# Altium schematic sheet panel.SchDoc
size A
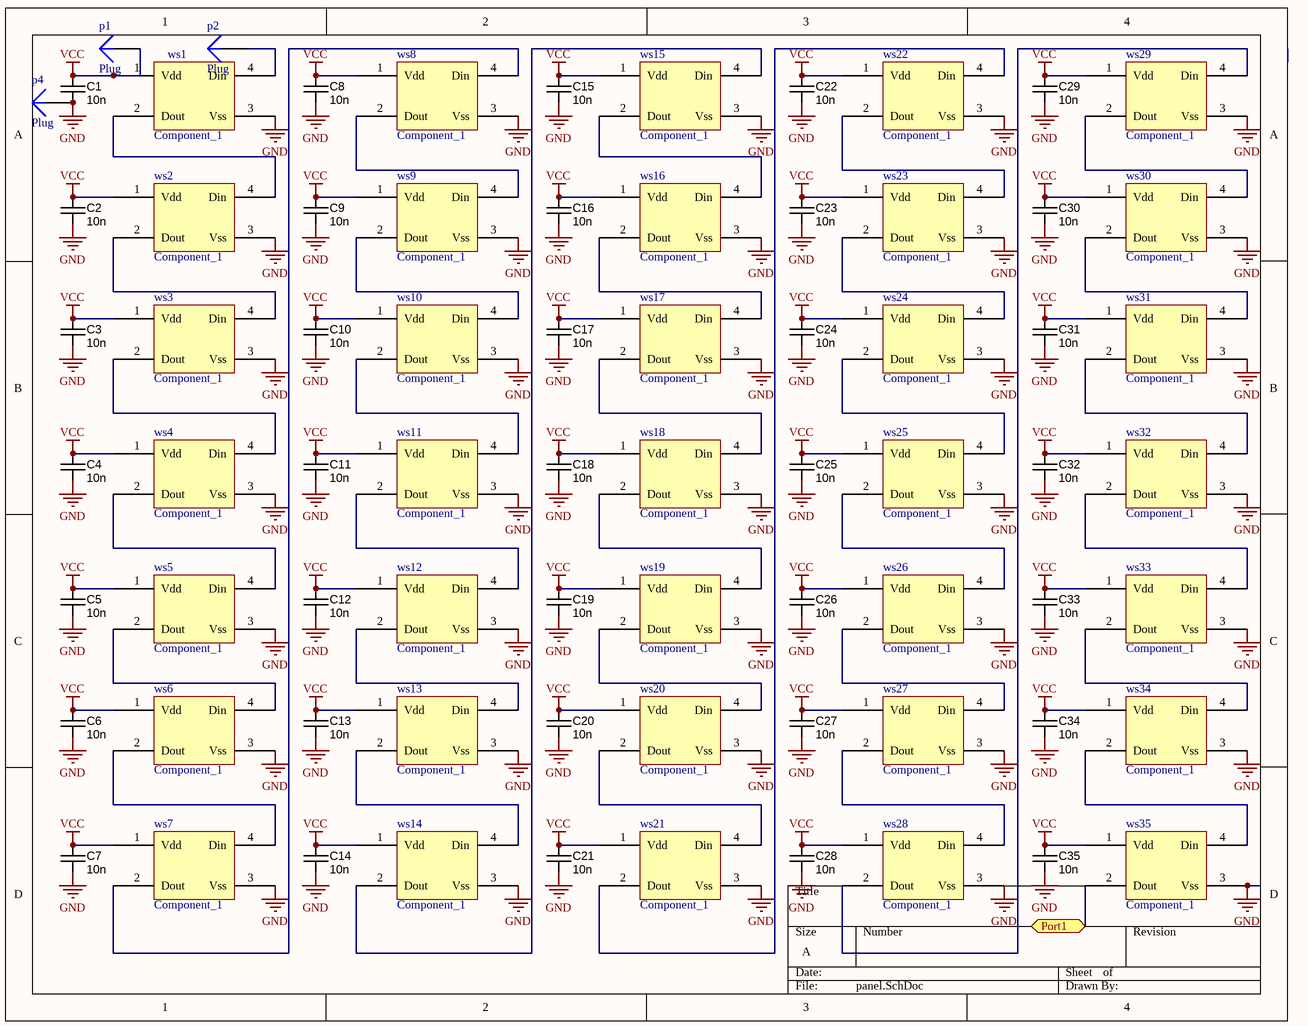
[diagram p0: panel.SchDoc]

## Parts
C1  value 10n  [CAPC1608X90N]  (hidden comment: approved sub OK)
C2  value 10n  [CAPC1608X90N]  (hidden comment: approved sub OK)
C3  value 10n  [CAPC1608X90N]  (hidden comment: approved sub OK)
C4  value 10n  [CAPC1608X90N]  (hidden comment: approved sub OK)
C5  value 10n  [CAPC1608X90N]  (hidden comment: approved sub OK)
C6  value 10n  [CAPC1608X90N]  (hidden comment: approved sub OK)
C7  value 10n  [CAPC1608X90N]  (hidden comment: approved sub OK)
C8  value 10n  [CAPC1608X90N]  (hidden comment: approved sub OK)
C9  value 10n  [CAPC1608X90N]  (hidden comment: approved sub OK)
C10  value 10n  [CAPC1608X90N]  (hidden comment: approved sub OK)
C11  value 10n  [CAPC1608X90N]  (hidden comment: approved sub OK)
C12  value 10n  [CAPC1608X90N]  (hidden comment: approved sub OK)
C13  value 10n  [CAPC1608X90N]  (hidden comment: approved sub OK)
C14  value 10n  [CAPC1608X90N]  (hidden comment: approved sub OK)
C15  value 10n  [CAPC1608X90N]  (hidden comment: approved sub OK)
C16  value 10n  [CAPC1608X90N]  (hidden comment: approved sub OK)
C17  value 10n  [CAPC1608X90N]  (hidden comment: approved sub OK)
C18  value 10n  [CAPC1608X90N]  (hidden comment: approved sub OK)
C19  value 10n  [CAPC1608X90N]  (hidden comment: approved sub OK)
C20  value 10n  [CAPC1608X90N]  (hidden comment: approved sub OK)
C21  value 10n  [CAPC1608X90N]  (hidden comment: approved sub OK)
C22  value 10n  [CAPC1608X90N]  (hidden comment: approved sub OK)
C23  value 10n  [CAPC1608X90N]  (hidden comment: approved sub OK)
C24  value 10n  [CAPC1608X90N]  (hidden comment: approved sub OK)
C25  value 10n  [CAPC1608X90N]  (hidden comment: approved sub OK)
C26  value 10n  [CAPC1608X90N]  (hidden comment: approved sub OK)
C27  value 10n  [CAPC1608X90N]  (hidden comment: approved sub OK)
C28  value 10n  [CAPC1608X90N]  (hidden comment: approved sub OK)
C29  value 10n  [CAPC1608X90N]  (hidden comment: approved sub OK)
C30  value 10n  [CAPC1608X90N]  (hidden comment: approved sub OK)
C31  value 10n  [CAPC1608X90N]  (hidden comment: approved sub OK)
C32  value 10n  [CAPC1608X90N]  (hidden comment: approved sub OK)
C33  value 10n  [CAPC1608X90N]  (hidden comment: approved sub OK)
C34  value 10n  [CAPC1608X90N]  (hidden comment: approved sub OK)
C35  value 10n  [CAPC1608X90N]  (hidden comment: approved sub OK)
p1  Plug  [PIN1]
p2  Plug  [PIN1]
p4  Plug  [PIN1]
ws1  Component_1  [SOP4]
ws2  Component_1  [SOP4]
ws3  Component_1  [SOP4]
ws4  Component_1  [SOP4]
ws5  Component_1  [SOP4]
ws6  Component_1  [SOP4]
ws7  Component_1  [SOP4]
ws8  Component_1  [SOP4]
ws9  Component_1  [SOP4]
ws10  Component_1  [SOP4]
ws11  Component_1  [SOP4]
ws12  Component_1  [SOP4]
ws13  Component_1  [SOP4]
ws14  Component_1  [SOP4]
ws15  Component_1  [SOP4]
ws16  Component_1  [SOP4]
ws17  Component_1  [SOP4]
ws18  Component_1  [SOP4]
ws19  Component_1  [SOP4]
ws20  Component_1  [SOP4]
ws21  Component_1  [SOP4]
ws22  Component_1  [SOP4]
ws23  Component_1  [SOP4]
ws24  Component_1  [SOP4]
ws25  Component_1  [SOP4]
ws26  Component_1  [SOP4]
ws27  Component_1  [SOP4]
ws28  Component_1  [SOP4]
ws29  Component_1  [SOP4]
ws30  Component_1  [SOP4]
ws31  Component_1  [SOP4]
ws32  Component_1  [SOP4]
ws33  Component_1  [SOP4]
ws34  Component_1  [SOP4]
ws35  Component_1  [SOP4]

## Ports
Port1

## Nets
GND: C1.2 C2.2 C3.2 C4.2 C5.2 C6.2 C7.2 C8.2 C9.2 C10.2 C11.2 C12.2 C13.2 C14.2 C15.2 C16.2 C17.2 C18.2 C19.2 C20.2 C21.2 C22.2 C23.2 C24.2 C25.2 C26.2 C27.2 C28.2 C29.2 C30.2 C31.2 C32.2 C33.2 C34.2 C35.2 p4.1 ws1.3(Vss) ws2.3(Vss) ws3.3(Vss) ws4.3(Vss) ws5.3(Vss) ws6.3(Vss) ws7.3(Vss) ws8.3(Vss) ws9.3(Vss) ws10.3(Vss) ws11.3(Vss) ws12.3(Vss) ws13.3(Vss) ws14.3(Vss) ws15.3(Vss) ws16.3(Vss) ws17.3(Vss) ws18.3(Vss) ws19.3(Vss) ws20.3(Vss) ws21.3(Vss) ws22.3(Vss) ws23.3(Vss) ws24.3(Vss) ws25.3(Vss) ws26.3(Vss) ws27.3(Vss) ws28.3(Vss) ws29.3(Vss) ws30.3(Vss) ws31.3(Vss) ws32.3(Vss) ws33.3(Vss) ws34.3(Vss) ws35.3(Vss)
VCC: C1.1 C2.1 C3.1 C4.1 C5.1 C6.1 C7.1 C8.1 C9.1 C10.1 C11.1 C12.1 C13.1 C14.1 C15.1 C16.1 C17.1 C18.1 C19.1 C20.1 C21.1 C22.1 C23.1 C24.1 C25.1 C26.1 C27.1 C28.1 C29.1 C30.1 C31.1 C32.1 C33.1 C34.1 C35.1 p1.1 ws1.1(Vdd) ws2.1(Vdd) ws3.1(Vdd) ws4.1(Vdd) ws5.1(Vdd) ws6.1(Vdd) ws7.1(Vdd) ws8.1(Vdd) ws9.1(Vdd) ws10.1(Vdd) ws11.1(Vdd) ws12.1(Vdd) ws13.1(Vdd) ws14.1(Vdd) ws15.1(Vdd) ws16.1(Vdd) ws17.1(Vdd) ws18.1(Vdd) ws19.1(Vdd) ws20.1(Vdd) ws21.1(Vdd) ws22.1(Vdd) ws23.1(Vdd) ws24.1(Vdd) ws25.1(Vdd) ws26.1(Vdd) ws27.1(Vdd) ws28.1(Vdd) ws29.1(Vdd) ws30.1(Vdd) ws31.1(Vdd) ws32.1(Vdd) ws33.1(Vdd) ws34.1(Vdd) ws35.1(Vdd)
Port1: ws35.2(Dout) ; port Port1
Netp2_1: p2.1 ws1.4(Din)
Netws1_2: ws1.2(Dout) ws2.4(Din)
Netws2_2: ws2.2(Dout) ws3.4(Din)
Netws3_2: ws3.2(Dout) ws4.4(Din)
Netws4_2: ws4.2(Dout) ws5.4(Din)
Netws5_2: ws5.2(Dout) ws6.4(Din)
Netws6_2: ws6.2(Dout) ws7.4(Din)
Netws7_2: ws7.2(Dout) ws8.4(Din)
Netws8_2: ws8.2(Dout) ws9.4(Din)
Netws9_2: ws9.2(Dout) ws10.4(Din)
Netws10_2: ws10.2(Dout) ws11.4(Din)
Netws11_2: ws11.2(Dout) ws12.4(Din)
Netws12_2: ws12.2(Dout) ws13.4(Din)
Netws13_2: ws13.2(Dout) ws14.4(Din)
Netws14_2: ws14.2(Dout) ws15.4(Din)
Netws15_2: ws15.2(Dout) ws16.4(Din)
Netws16_2: ws16.2(Dout) ws17.4(Din)
Netws17_2: ws17.2(Dout) ws18.4(Din)
Netws18_2: ws18.2(Dout) ws19.4(Din)
Netws19_2: ws19.2(Dout) ws20.4(Din)
Netws20_2: ws20.2(Dout) ws21.4(Din)
Netws21_2: ws21.2(Dout) ws22.4(Din)
Netws22_2: ws22.2(Dout) ws23.4(Din)
Netws23_2: ws23.2(Dout) ws24.4(Din)
Netws24_2: ws24.2(Dout) ws25.4(Din)
Netws25_2: ws25.2(Dout) ws26.4(Din)
Netws26_2: ws26.2(Dout) ws27.4(Din)
Netws27_2: ws27.2(Dout) ws28.4(Din)
Netws28_2: ws28.2(Dout) ws29.4(Din)
Netws29_2: ws29.2(Dout) ws30.4(Din)
Netws30_2: ws30.2(Dout) ws31.4(Din)
Netws31_2: ws31.2(Dout) ws32.4(Din)
Netws32_2: ws32.2(Dout) ws33.4(Din)
Netws33_2: ws33.2(Dout) ws34.4(Din)
Netws34_2: ws34.2(Dout) ws35.4(Din)

## Library data of the parts
C1-C35 = CAPC_10n_0603_X7R_100V_10%: Capacitor SMD Cer 10nF 10% 100V X7R 0603; Manufacturer: Murata Electronics North America; Manufacturer Part Number: GCM188R72A103KA37D; Ratings: 100V; X7R; Material: ceramic; SCDType: undef; Package / Case: 0603 (1608 metric); Tolerance: ±10%; Supplier 1: Digi-Key; Supplier Part Number 1: 490-4781-1-ND
p1 p2 p4 = Plug: LatestRevisionDate: 17-Jul-2002; LatestRevisionNote: Re-released for DXP Platform.; Publisher: Altium Limited